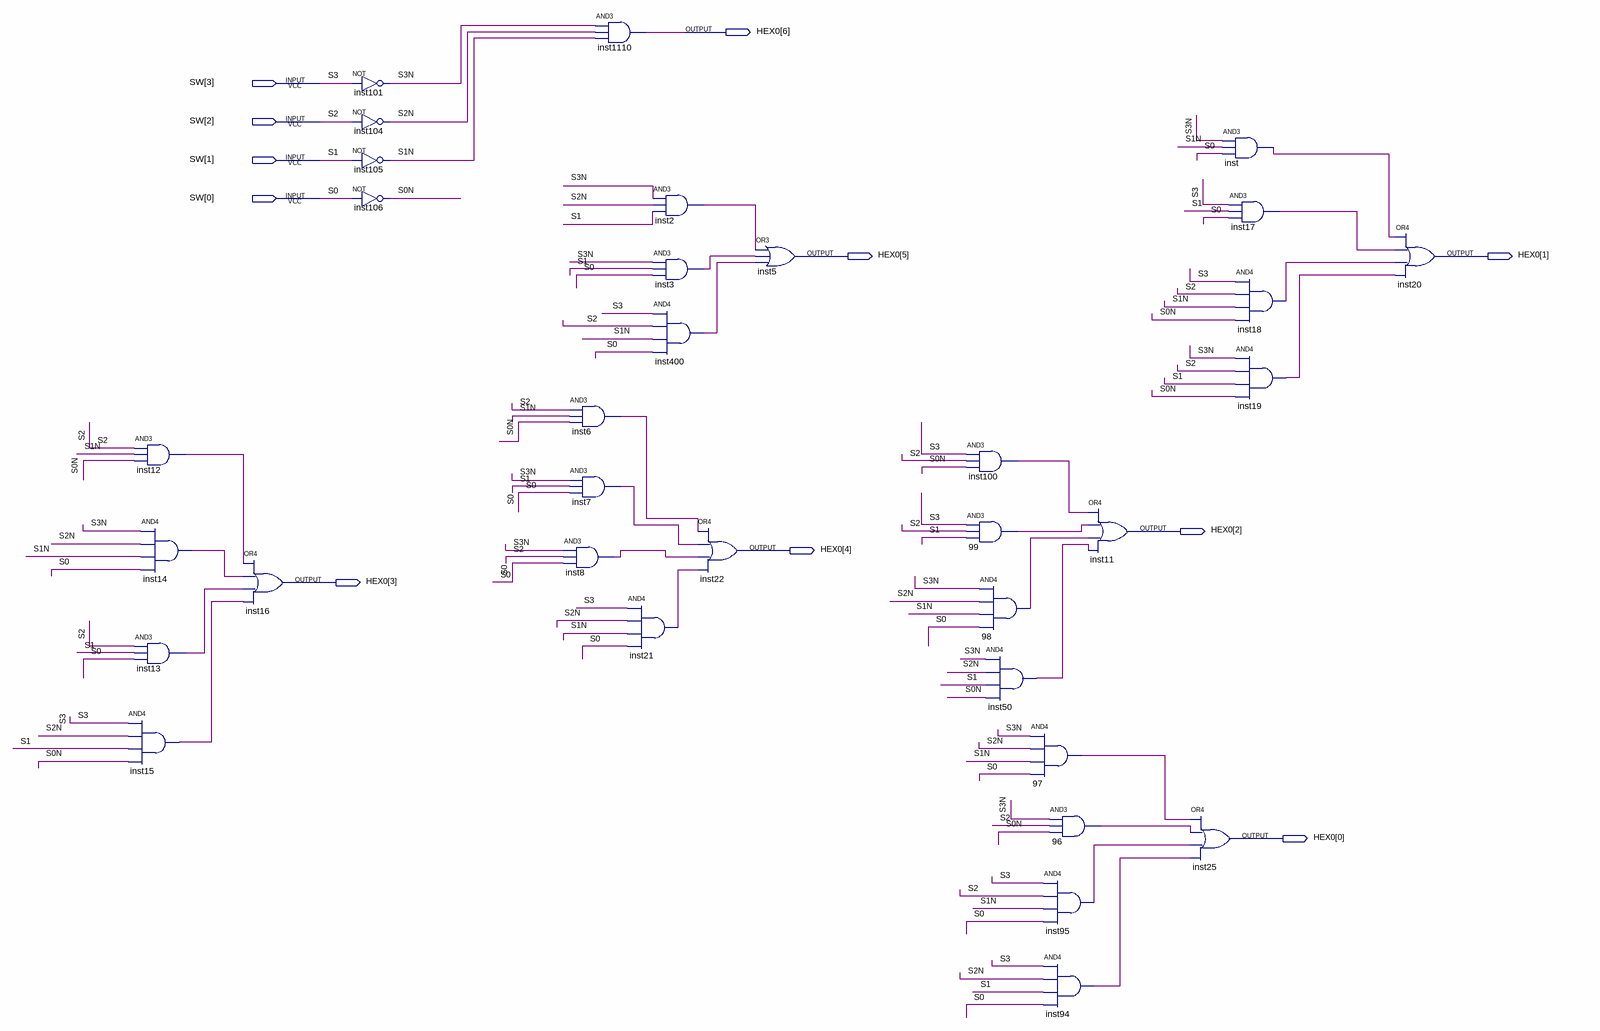
[diagram p0: schematic sheet]
// Quartus schematic lab2_sop1.bdf as structural Verilog: 34 symbols, 11 pins
module lab2_sop1 (
  input  [3:0] SW,
  output [6:0] HEX0
);

  wire inst2_out, inst3_out, inst6_out, inst7_out, inst8_out, inst12_out, inst13_out, inst14_out, inst15_out,
       inst17_out, inst18_out, inst19_out, inst21_out, inst50_out, inst94_out, inst95_out, inst100_out,
       inst400_out, inst_out, n96_out, n97_out, n98_out, n99_out, S0N, S1N, S2N, S3N;

  and inst12 (inst12_out, SW[2], S1N, S0N);
  and inst14 (inst14_out, S3N, S2N, S1N, SW[0]);
  and inst13 (inst13_out, SW[2], SW[1], SW[0]);
  and inst15 (inst15_out, SW[3], S2N, SW[1], S0N);
  or inst16 (HEX0[3], inst12_out, inst14_out, inst13_out, inst15_out);
  not inst101 (S3N, SW[3]);
  not inst104 (S2N, SW[2]);
  not inst105 (S1N, SW[1]);
  not inst106 (S0N, SW[0]);
  and inst1110 (HEX0[6], S3N, S2N, S1N);
  and inst6 (inst6_out, SW[2], S1N, S0N);
  and inst7 (inst7_out, S3N, SW[1], SW[0]);
  and inst8 (inst8_out, S3N, SW[2], SW[0]);
  and inst2 (inst2_out, S3N, S2N, SW[1]);
  and inst3 (inst3_out, S3N, SW[1], SW[0]);
  and inst400 (inst400_out, SW[3], SW[2], S1N, SW[0]);
  and inst21 (inst21_out, SW[3], S2N, S1N, SW[0]);
  or inst22 (HEX0[4], inst6_out, inst7_out, inst8_out, inst21_out);
  or inst5 (HEX0[5], inst2_out, inst3_out, inst400_out);
  and inst100 (inst100_out, SW[3], SW[2], S0N);
  and u_99 (n99_out, SW[3], SW[2], SW[1]);
  and u_98 (n98_out, S3N, S2N, S1N, SW[0]);
  and inst50 (inst50_out, S3N, S2N, SW[1], S0N);
  and u_97 (n97_out, S3N, S2N, S1N, SW[0]);
  and u_96 (n96_out, S3N, SW[2], S0N);
  and inst95 (inst95_out, SW[3], SW[2], S1N, SW[0]);
  and inst94 (inst94_out, SW[3], S2N, SW[1], SW[0]);
  or inst11 (HEX0[2], inst100_out, n99_out, n98_out, inst50_out);
  and inst (inst_out, S3N, S1N, SW[0]);
  or inst25 (HEX0[0], n97_out, n96_out, inst95_out, inst94_out);
  and inst17 (inst17_out, SW[3], SW[1], SW[0]);
  and inst18 (inst18_out, SW[3], SW[2], S1N, S0N);
  and inst19 (inst19_out, S3N, SW[2], SW[1], S0N);
  or inst20 (HEX0[1], inst_out, inst17_out, inst18_out, inst19_out);

  // Other names for the same wires on the sheet: S0 = SW[0]; S1 = SW[1]; S2 = SW[2]; S3 = SW[3]
endmodule
